# Altium schematic sheet temp_sensor_board.SchDoc
size A4
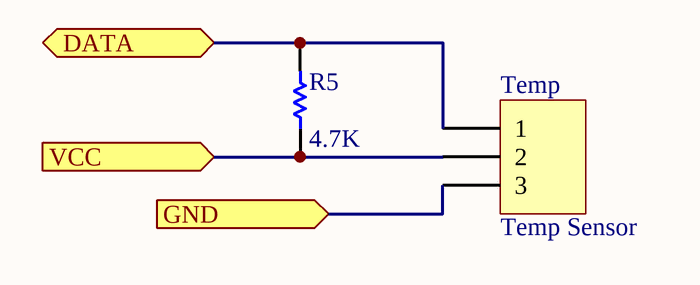
[diagram p0: temp_sensor_board.SchDoc]

## Parts
R5  value 4.7K  [AXIAL-0.3]
Temp  Temp Sensor  [HDR1X3]

## Ports
DATA (bidir), GND (in), VCC (in)

## Nets
DATA: R5.2 Temp.1 ; port DATA
GND: Temp.3 ; port GND
VCC: R5.1 Temp.2 ; port VCC

## Library data of the parts
R5 = Res1: Pull up; Published: 8-Jun-2000; LatestRevisionDate: 17-Jul-2002; LatestRevisionNote: Re-released for DXP Platform.; PackageReference: AXIAL-0.3; Publisher: Altium Limited; PackageDescription: Axial Device, Thru-Hole; 2 Leads; 0.3 in Pin Spacing
Temp = Header 3: Header, 3-Pin; LatestRevisionDate: 17-Jul-2002; LatestRevisionNote: Re-released for DXP Platform.; Publisher: Altium Limited